# Altium schematic sheet SIM_slots_1.SchDoc
size A3
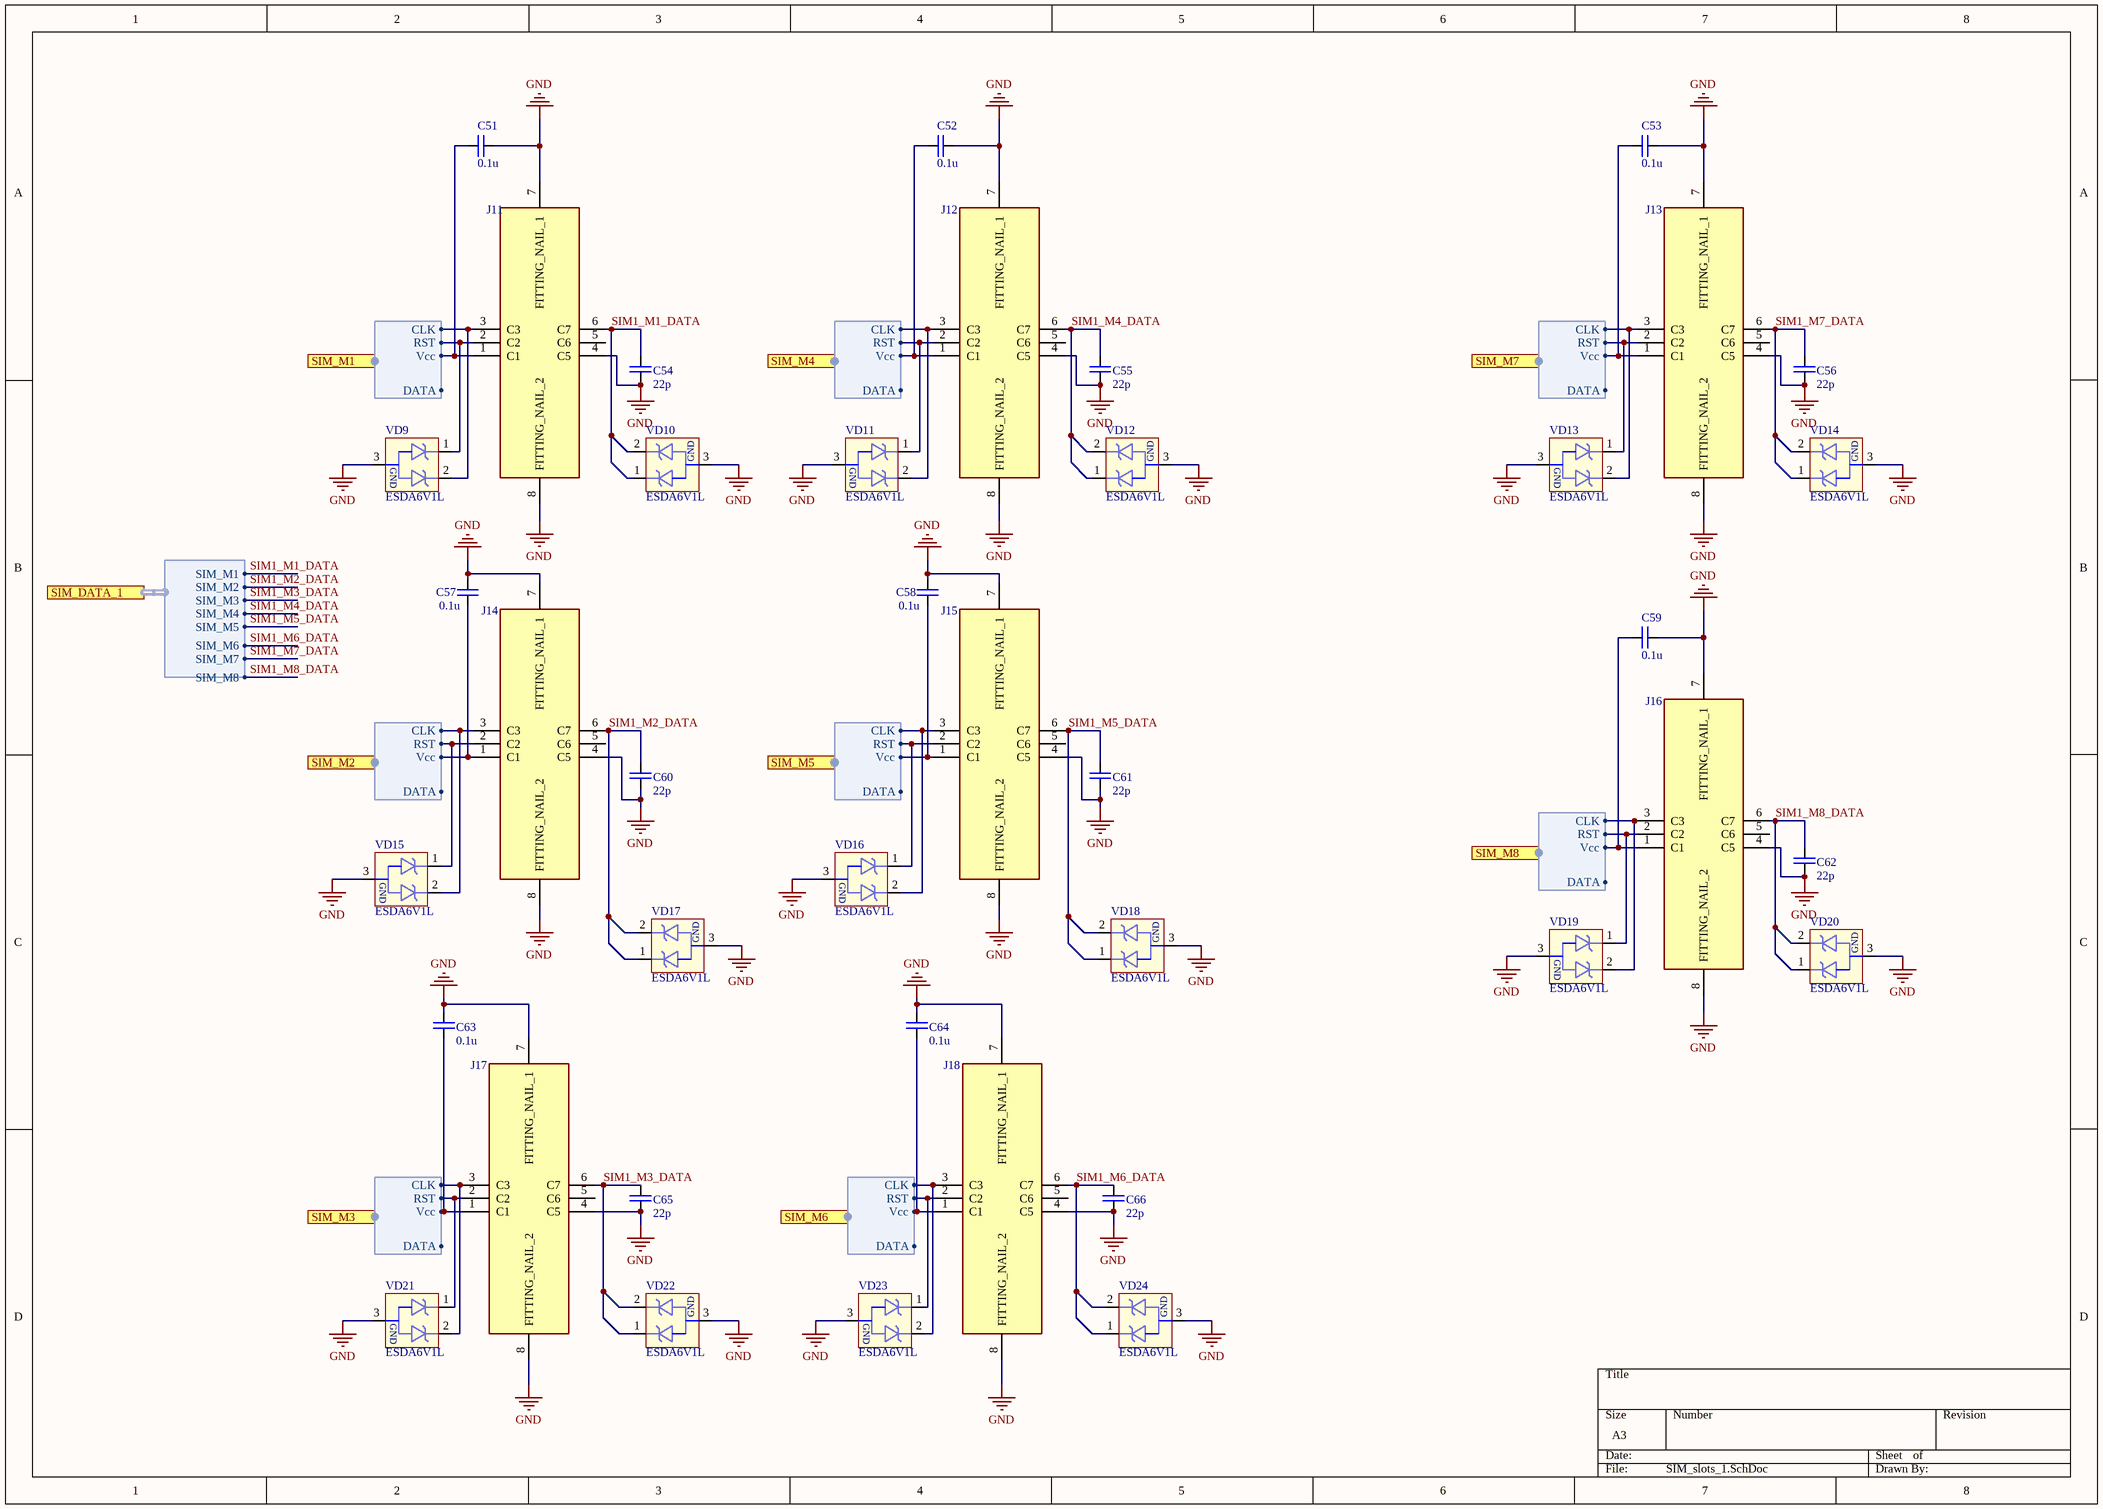
[diagram p0: SIM_slots_1.SchDoc]

## Parts
C51  value 0.1u  [C0402]  (hidden comment: Конденсатор SMD, 0.1мкФ, X7R, 25В, 10%, 0402)
C52  value 0.1u  [C0402]  (hidden comment: Конденсатор SMD, 0.1мкФ, X7R, 25В, 10%, 0402)
C53  value 0.1u  [C0402]  (hidden comment: Конденсатор SMD, 0.1мкФ, X7R, 25В, 10%, 0402)
C54  value 22p  [C0402]  (hidden comment: Конденсатор SMD, 22пФ, X7R, 50В, 10%, 0402)
C55  value 22p  [C0402]  (hidden comment: Конденсатор SMD, 22пФ, X7R, 50В, 10%, 0402)
C56  value 22p  [C0402]  (hidden comment: Конденсатор SMD, 22пФ, X7R, 50В, 10%, 0402)
C57  value 0.1u  [C0402]  (hidden comment: Конденсатор SMD, 0.1мкФ, X7R, 25В, 10%, 0402)
C58  value 0.1u  [C0402]  (hidden comment: Конденсатор SMD, 0.1мкФ, X7R, 25В, 10%, 0402)
C59  value 0.1u  [C0402]  (hidden comment: Конденсатор SMD, 0.1мкФ, X7R, 25В, 10%, 0402)
C60  value 22p  [C0402]  (hidden comment: Конденсатор SMD, 22пФ, X7R, 50В, 10%, 0402)
C61  value 22p  [C0402]  (hidden comment: Конденсатор SMD, 22пФ, X7R, 50В, 10%, 0402)
C62  value 22p  [C0402]  (hidden comment: Конденсатор SMD, 22пФ, X7R, 50В, 10%, 0402)
C63  value 0.1u  [C0402]  (hidden comment: Конденсатор SMD, 0.1мкФ, X7R, 25В, 10%, 0402)
C64  value 0.1u  [C0402]  (hidden comment: Конденсатор SMD, 0.1мкФ, X7R, 25В, 10%, 0402)
C65  value 22p  [C0402]  (hidden comment: Конденсатор SMD, 22пФ, X7R, 50В, 10%, 0402)
C66  value 22p  [C0402]  (hidden comment: Конденсатор SMD, 22пФ, X7R, 50В, 10%, 0402)
J11  47388-2001  [473882001]  (value not drawn)
J12  47388-2001  [473882001]  (value not drawn)
J13  47388-2001  [473882001]  (value not drawn)
J14  47388-2001  [473882001]  (value not drawn)
J15  47388-2001  [473882001]  (value not drawn)
J16  47388-2001  [473882001]  (value not drawn)
J17  47388-2001  [473882001]  (value not drawn)
J18  47388-2001  [473882001]  (value not drawn)
VD9  Диод защитный, ESDA6V1L  [SOT23-3L]  (value not drawn)
VD10  Диод защитный, ESDA6V1L  [SOT23-3L]  (value not drawn)
VD11  Диод защитный, ESDA6V1L  [SOT23-3L]  (value not drawn)
VD12  Диод защитный, ESDA6V1L  [SOT23-3L]  (value not drawn)
VD13  Диод защитный, ESDA6V1L  [SOT23-3L]  (value not drawn)
VD14  Диод защитный, ESDA6V1L  [SOT23-3L]  (value not drawn)
VD15  Диод защитный, ESDA6V1L  [SOT23-3L]  (value not drawn)
VD16  Диод защитный, ESDA6V1L  [SOT23-3L]  (value not drawn)
VD17  Диод защитный, ESDA6V1L  [SOT23-3L]  (value not drawn)
VD18  Диод защитный, ESDA6V1L  [SOT23-3L]  (value not drawn)
VD19  Диод защитный, ESDA6V1L  [SOT23-3L]  (value not drawn)
VD20  Диод защитный, ESDA6V1L  [SOT23-3L]  (value not drawn)
VD21  Диод защитный, ESDA6V1L  [SOT23-3L]  (value not drawn)
VD22  Диод защитный, ESDA6V1L  [SOT23-3L]  (value not drawn)
VD23  Диод защитный, ESDA6V1L  [SOT23-3L]  (value not drawn)
VD24  Диод защитный, ESDA6V1L  [SOT23-3L]  (value not drawn)

## Ports
SIM_DATA_1 (harness SIM_DATA_1), SIM_M1 (harness SIM), SIM_M2 (harness SIM), SIM_M3 (harness SIM), SIM_M4 (harness SIM), SIM_M5 (harness SIM), SIM_M6 (harness SIM), SIM_M7 (harness SIM), SIM_M8 (harness SIM)

## Harnesses
SIM: Vcc, RST, CLK, DATA
SIM_DATA_1: SIM_M1, SIM_M2, SIM_M3, SIM_M4, SIM_M5, SIM_M6, SIM_M7, SIM_M8

## Nets
GND: C51.2 C52.2 C53.2 C54.1 C55.1 C56.1 C57.2 C58.2 C59.2 C60.1 C61.1 C62.1 C63.2 C64.2 C65.1 C66.1 J11.4(C5) J11.7(FITTING_NAIL_1) J11.8(FITTING_NAIL_2) J12.4(C5) J12.7(FITTING_NAIL_1) J12.8(FITTING_NAIL_2) J13.4(C5) J13.7(FITTING_NAIL_1) J13.8(FITTING_NAIL_2) J14.4(C5) J14.7(FITTING_NAIL_1) J14.8(FITTING_NAIL_2) J15.4(C5) J15.7(FITTING_NAIL_1) J15.8(FITTING_NAIL_2) J16.4(C5) J16.7(FITTING_NAIL_1) J16.8(FITTING_NAIL_2) J17.4(C5) J17.7(FITTING_NAIL_1) J17.8(FITTING_NAIL_2) J18.4(C5) J18.7(FITTING_NAIL_1) J18.8(FITTING_NAIL_2) VD9.3(GND) VD10.3(GND) VD11.3(GND) VD12.3(GND) VD13.3(GND) VD14.3(GND) VD15.3(GND) VD16.3(GND) VD17.3(GND) VD18.3(GND) VD19.3(GND) VD20.3(GND) VD21.3(GND) VD22.3(GND) VD23.3(GND) VD24.3(GND)
SIM1_M1_DATA: C54.2 J11.6(C7) VD10.1 VD10.2 ; port SIM_DATA_1.SIM_M1
SIM1_M2_DATA: C60.2 J14.6(C7) VD17.1 VD17.2 ; port SIM_DATA_1.SIM_M2
SIM1_M3_DATA: C65.2 J17.6(C7) VD22.1 VD22.2 ; port SIM_DATA_1.SIM_M3
SIM1_M4_DATA: C55.2 J12.6(C7) VD12.1 VD12.2 ; port SIM_DATA_1.SIM_M4
SIM1_M5_DATA: C61.2 J15.6(C7) VD18.1 VD18.2 ; port SIM_DATA_1.SIM_M5
SIM1_M6_DATA: C66.2 J18.6(C7) VD24.1 VD24.2 ; port SIM_DATA_1.SIM_M6
SIM1_M7_DATA: C56.2 J13.6(C7) VD14.1 VD14.2 ; port SIM_DATA_1.SIM_M7
SIM1_M8_DATA: C62.2 J16.6(C7) VD20.1 VD20.2 ; port SIM_DATA_1.SIM_M8
NetC51_1: C51.1 J11.1(C1) ; port SIM_M1.Vcc
NetC52_1: C52.1 J12.1(C1) ; port SIM_M4.Vcc
NetC53_1: C53.1 J13.1(C1) ; port SIM_M7.Vcc
NetC57_1: C57.1 J14.1(C1) ; port SIM_M2.Vcc
NetC58_1: C58.1 J15.1(C1) ; port SIM_M5.Vcc
NetC59_1: C59.1 J16.1(C1) ; port SIM_M8.Vcc
NetC63_1: C63.1 J17.1(C1) ; port SIM_M3.Vcc
NetC64_1: C64.1 J18.1(C1) ; port SIM_M6.Vcc
NetJ11_2: J11.2(C2) VD9.1 ; port SIM_M1.RST
NetJ11_3: J11.3(C3) VD9.2 ; port SIM_M1.CLK
NetJ12_2: J12.2(C2) VD11.1 ; port SIM_M4.RST
NetJ12_3: J12.3(C3) VD11.2 ; port SIM_M4.CLK
NetJ13_2: J13.2(C2) VD13.1 ; port SIM_M7.RST
NetJ13_3: J13.3(C3) VD13.2 ; port SIM_M7.CLK
NetJ14_2: J14.2(C2) VD15.1 ; port SIM_M2.RST
NetJ14_3: J14.3(C3) VD15.2 ; port SIM_M2.CLK
NetJ15_2: J15.2(C2) VD16.1 ; port SIM_M5.RST
NetJ15_3: J15.3(C3) VD16.2 ; port SIM_M5.CLK
NetJ16_2: J16.2(C2) VD19.1 ; port SIM_M8.RST
NetJ16_3: J16.3(C3) VD19.2 ; port SIM_M8.CLK
NetJ17_2: J17.2(C2) VD21.1 ; port SIM_M3.RST
NetJ17_3: J17.3(C3) VD21.2 ; port SIM_M3.CLK
NetJ18_2: J18.2(C2) VD23.1 ; port SIM_M6.RST
NetJ18_3: J18.3(C3) VD23.2 ; port SIM_M6.CLK

Not connected (* = marked no-connect by the designer): J11 5(C6); J12 5(C6); J13 5(C6); J14 5(C6); J15 5(C6); J16 5(C6); J17 5(C6); J18 5(C6)

## Library data of the parts
C51-C53 C57-C59 C63 C64 = C0402: Chip Capacitor 0402; Assembly: 0.1u_X7R_25V_10%_0402; Voltage_assembly: 25V; Tolerance: 10%; Voltage: 25В; TemperatureCoeff: X7R; Family: Конденсатор SMD; Capacitance: 0.1мкФ; Package: 0402
C54-C56 C60-C62 C65 C66 = C0402: Chip Capacitor 0402; Assembly: 22p_X7R_50V_10%_0402; Voltage_assembly: 50V; Tolerance: 10%; Voltage: 50В; TemperatureCoeff: X7R; Family: Конденсатор SMD; Capacitance: 22пФ; Package: 0402
J11-J18 = 47388-2001: Connector; Manufacturer_Name: Molex; Datasheet Link: https://www.molex.com/webdocs/datasheets/pdf/en-us/0473882001_MEMORY_CARD_SOCKET.pdf; Height: 1mm; Manufacturer_Part_Number: 47388-2001; Arrow Part Number: 47388-2001; Arrow Price/Stock: https://www.arrow.com/en/products/47388-2001/molex; Mouser Part Number: 538-47388-2001; Mouser Price/Stock: https://www.mouser.co.uk/ProductDetail/Molex/47388-2001?qs=KKUMDL8WE1K2q3cPEOwmLw%3D%3D
VD9-VD24 = ESDA6V1L: Dual diode array for ESD protection; Manufacturer: STMicroelectronics; Family: Диод защитный; Package: SOT23; Assembly: ESDA6V1L; PartNumber: ESDA6V1L